# Altium project Kintex_SDR.PrjPcb (part 3 of 3)
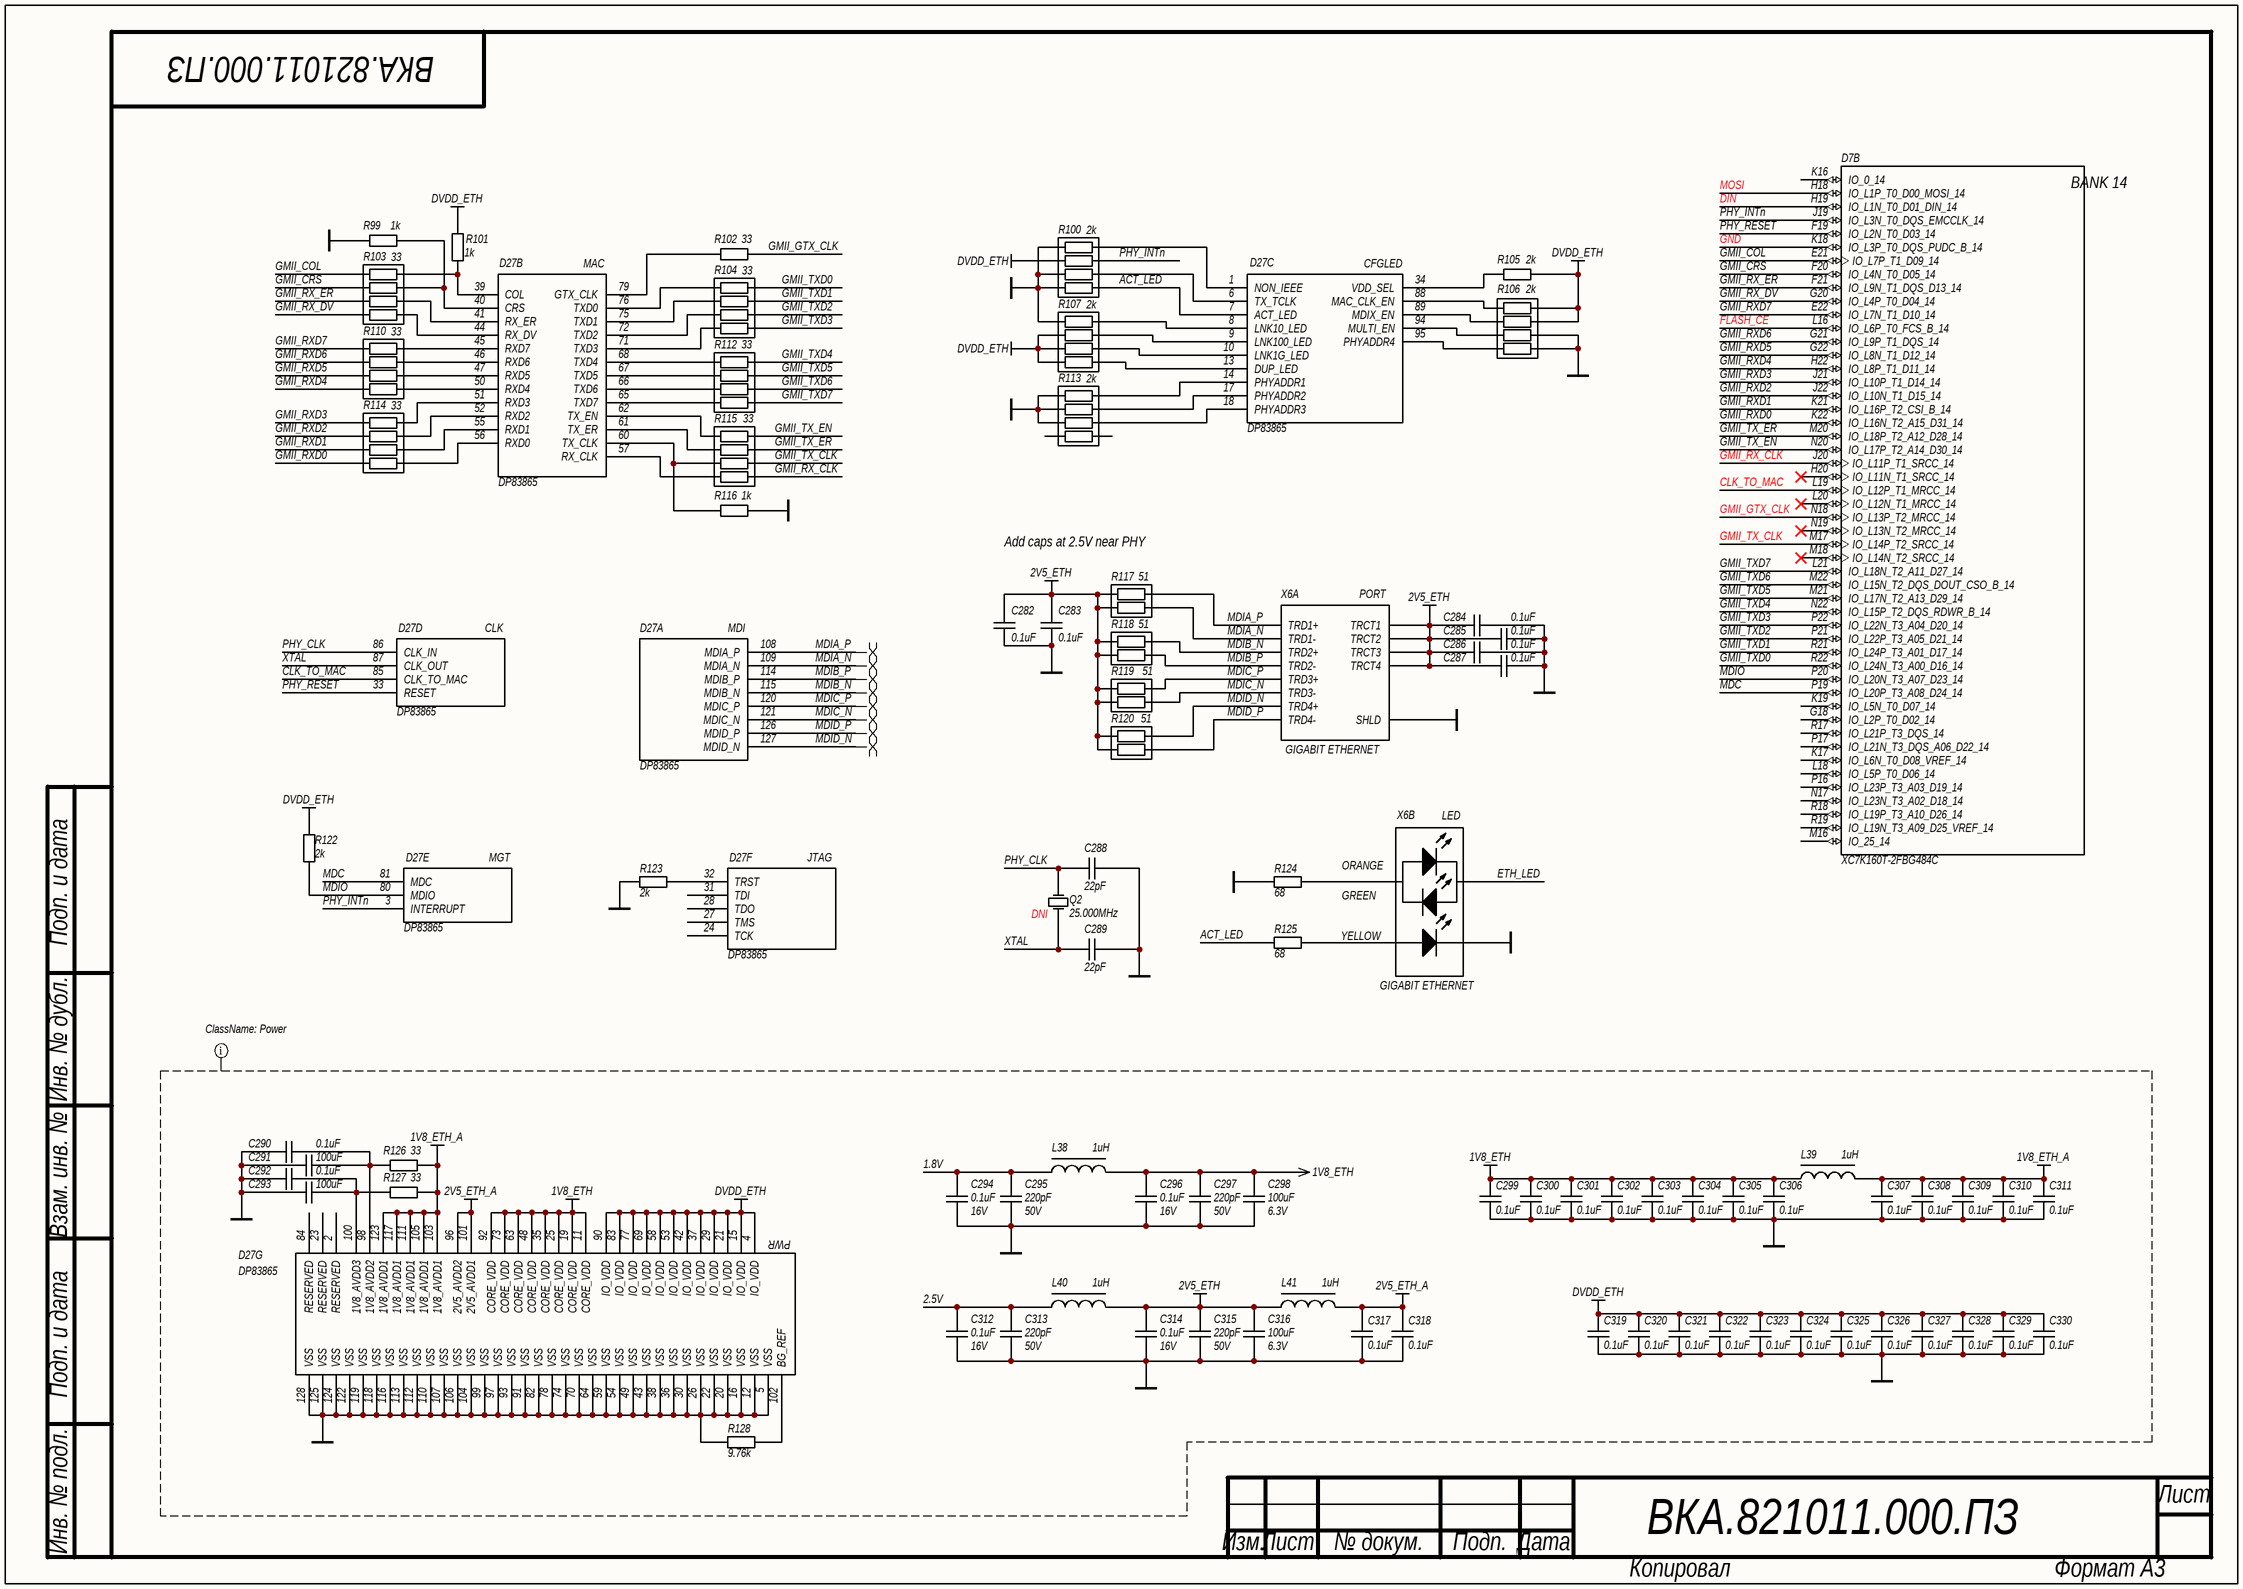
[diagram p6: Ethernet.SchDoc]

## Nets that join several sheets
1.0V: PowerSupply (C16.2 K2.1 L4.2 R11.2), FPGAPower (C84.2 C85.2 L12.1)
1.8V: PowerSupply (C27.2 K5.1 L7.2 R22.2), FPGAPower (9 pins), Ethernet (C294.2 C295.2 L38.1)
2.5V: PowerSupply (C17.2 K3.1 L5.2 R12.2), Ethernet (C312.2 C313.2 L40.1)
3.3V: PowerSupply (C29.2 K6.1 L8.2 R23.2), FPGAPower (9 pins), DaughterBoard (6 pins)
3V3_DVDD: FPGAPower (28 pins), Configuration&Clocking&SRAM (22 pins), DaughterBoard (5 pins)
6V: PowerSupply (C15.2 K1.1 L3.2 R10.2), Configuration&Clocking&SRAM (5 pins), Codec's (16 pins), DaughterBoard (6 pins)
AGND_RX: Codec's (31 pins), DaughterBoard (19 pins)
AGND_TX: PowerSupply (67 pins), FPGAPower (204 pins), Configuration&Clocking&SRAM (111 pins), Codec's (58 pins), DaughterBoard (47 pins), Ethernet (101 pins)
DVDD_ADC: FPGAPower (16 pins), Codec's (C331.1 D15.42 R97.1)
DVDD_DAC: FPGAPower (16 pins), Codec's (14 pins)
DVDD_ETH: FPGAPower (16 pins), Ethernet (33 pins)
DVDD_RAM: FPGAPower (16 pins), Configuration&Clocking&SRAM (25 pins)
button: Configuration&Clocking&SRAM (C141.2 R53.1 SB1.1), DaughterBoard (D7.F14)
CLK_ADC_N: Configuration&Clocking&SRAM (C134.1), Codec's (D15.19 R96.1)
CLK_ADC_P: Configuration&Clocking&SRAM (C135.1), Codec's (D15.18 R96.2)
CLK_DAC_N: Configuration&Clocking&SRAM (C137.1), Codec's (D18.61 R94.1)
CLK_DAC_P: Configuration&Clocking&SRAM (C136.1), Codec's (D18.62 R94.2)
CLK_DAC_REF_N: Configuration&Clocking&SRAM (C138.1), Codec's (D18.3 R95.1)
CLK_DAC_REF_P: Configuration&Clocking&SRAM (C139.1), Codec's (D18.2 R95.2)
CLK_FPGA_N: Configuration&Clocking&SRAM (R40.4 R41.1), Codec's (D7.Y9)
CLK_FPGA_P: Configuration&Clocking&SRAM (R40.3 R41.2), Codec's (D7.W9)
CLK_LOCK: Configuration&Clocking&SRAM (C129.1 D8.3), DaughterBoard (D7.W16)
CLK_REFMON: Configuration&Clocking&SRAM (D8.2), DaughterBoard (D7.Y16)
CLK_RESET: Configuration&Clocking&SRAM (D8.23), DaughterBoard (D7.AA20)
CLK_SCLK: Configuration&Clocking&SRAM (D8.16), DaughterBoard (D7.AB22)
CLK_SDI: Configuration&Clocking&SRAM (D8.22), DaughterBoard (D7.AB21)
CLK_SDO: Configuration&Clocking&SRAM (D8.21), DaughterBoard (D7.AA21)
CLK_SEN: Configuration&Clocking&SRAM (D8.17), DaughterBoard (D7.Y22)
CLK_STATUS: Configuration&Clocking&SRAM (D8.6), DaughterBoard (D7.Y17)
CLK_SYNC: Configuration&Clocking&SRAM (D8.8), DaughterBoard (D7.W17)
clock_rx_n: Configuration&Clocking&SRAM (R54.3), DaughterBoard (X5.75)
clock_rx_p: Configuration&Clocking&SRAM (R54.4), DaughterBoard (X5.77)
clock_tx_n: Configuration&Clocking&SRAM (R57.3), DaughterBoard (X5.12)
clock_tx_p: Configuration&Clocking&SRAM (R57.4), DaughterBoard (X5.14)
DIN: Configuration&Clocking&SRAM (D12.2), Ethernet (D7.H19)
ETH_LED: DaughterBoard (D7.R16), Ethernet (X6.16)
FLASH_CE: Configuration&Clocking&SRAM (D12.1 R49.1), Ethernet (D7.L16)
IOUTA_N: Codec's (D18.56), DaughterBoard (X5.61)
IOUTA_P: Codec's (D18.57), DaughterBoard (X5.59)
IOUTB_N: Codec's (D18.67), DaughterBoard (X5.49)
IOUTB_P: Codec's (D18.66), DaughterBoard (X5.51)
LED1: Configuration&Clocking&SRAM (R45.2), DaughterBoard (D7.W20)
LED2: Configuration&Clocking&SRAM (R51.2), DaughterBoard (D7.Y21)
LED3: Configuration&Clocking&SRAM (R52.2), DaughterBoard (D7.V18)
LED4: Configuration&Clocking&SRAM (R55.2), DaughterBoard (D7.AA19)
LED5: Configuration&Clocking&SRAM (R59.2), DaughterBoard (D7.AB20)
MOSI: Configuration&Clocking&SRAM (D12.5), Ethernet (D7.H18)
PHY_CLK: Configuration&Clocking&SRAM (D8.33), Ethernet (C288.1 D27.86 Q2.3)
PPS_IN: Configuration&Clocking&SRAM (D10.2), DaughterBoard (D7.V19)
RXD: Configuration&Clocking&SRAM (R56.1), DaughterBoard (D7.A11)
SCL: Configuration&Clocking&SRAM (D11.6 R46.1), DaughterBoard (D7.A9 X5.16 X5.79)
SDA: Configuration&Clocking&SRAM (D11.5 R47.1), DaughterBoard (D7.A8 X5.18 X5.81)
TXD: Configuration&Clocking&SRAM (R58.1), DaughterBoard (D7.A10)
VINA_N: Codec's (R86.2), DaughterBoard (X5.126)
VINA_P: Codec's (R85.2), DaughterBoard (X5.124)
VINB_N: Codec's (R71.2), DaughterBoard (X5.116)
VINB_P: Codec's (R70.2), DaughterBoard (X5.114)